# EAGLE schematic board (EAGLE 7.2.0)
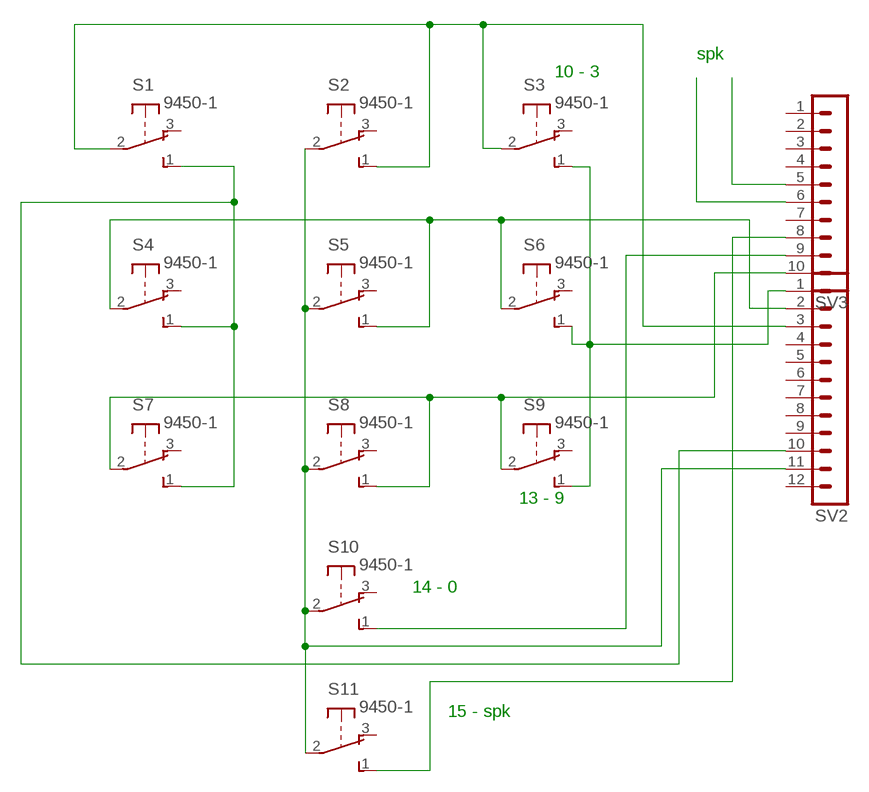
[diagram p0: schematic, sheet 1]

## Parts
S1  9450-1  [9450-1]
S2  9450-1  [9450-1]
S3  9450-1  [9450-1]
S4  9450-1  [9450-1]
S5  9450-1  [9450-1]
S6  9450-1  [9450-1]
S7  9450-1  [9450-1]
S8  9450-1  [9450-1]
S9  9450-1  [9450-1]
S10  9450-1  [9450-1]
S11  9450-1  [9450-1]
SV2  MA12-1  [MA12-1]
SV3  MA10-1  [MA10-1]

## Nets
N$1: S1.1(S) S4.1(S) S7.1(S) SV2.10
N$2: S2.2(P) S5.2(P) S8.2(P) S10.2(P) S11.2(P) SV2.11
N$3: S1.2(P) S2.1(S) S3.2(P) SV2.3
N$4: S4.2(P) S5.1(S) S6.2(P) SV2.2
N$5: S7.2(P) S8.1(S) S9.2(P) SV3.10
N$6: SV3.5
N$7: S3.1(S) S6.1(S) S9.1(S) SV2.1
N$8: SV3.6
N$9: S10.1(S) SV3.9
N$10: S11.1(S) SV3.8
Unconnected: S1.3(O) S2.3(O) S3.3(O) S4.3(O) S5.3(O) S6.3(O) S7.3(O) S8.3(O) S9.3(O) S10.3(O) S11.3(O) SV2.4 SV2.5 SV2.6 SV2.7 SV2.8 SV2.9 SV2.12 SV3.1 SV3.2 SV3.3 SV3.4 SV3.7

## Notes on the sheet
- spk
- 10 - 3
- 13 - 9
- 14 - 0
- 15 - spk

## Library data of the parts
S1-S11 = switch-misc:9450-1: MARQUARDT SWITCH
SV2 = con-lstb:MA12-1: PIN HEADER; OC_FARNELL: unknown; OC_NEWARK: unknown
SV3 = con-lstb:MA10-1: PIN HEADER; OC_FARNELL: unknown; OC_NEWARK: unknown